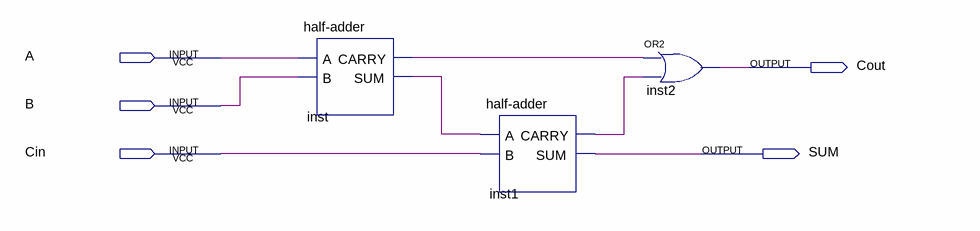
[diagram p0: schematic sheet]
// Quartus schematic full-adder.bdf as structural Verilog: 3 symbols, 5 pins
module \full-adder  (
  input  A,
  input  B,
  input  Cin,
  output Cout,
  output SUM
);

  wire inst1_carry, inst_carry, inst_sum;

  \half-adder  inst (.A(A), .B(B), .CARRY(inst_carry), .SUM(inst_sum));
  \half-adder  inst1 (.A(inst_sum), .B(Cin), .CARRY(inst1_carry), .SUM(SUM));
  or inst2 (Cout, inst_carry, inst1_carry);
endmodule
